# EAGLE design W032 (EAGLE 6.6.0)
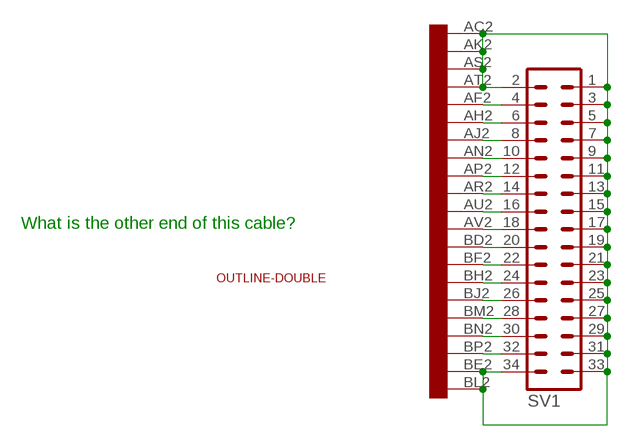
[diagram p0: schematic, sheet 1]

## Parts
SV1  MA17-2  [MA17-2]
U$1  OUTLINE-DOUBLE  [DOUBLE]
U$2  DOUBLE  [EDGE-CON4]

## Nets
GND: SV1.1 SV1.2 SV1.3 SV1.5 SV1.7 SV1.9 SV1.11 SV1.13 SV1.15 SV1.17 SV1.19 SV1.21 SV1.23 SV1.25 SV1.27 SV1.29 SV1.31 SV1.33 SV1.34 U$2.AC2 U$2.AK2 U$2.AS2 U$2.AT2 U$2.BE2 U$2.BL2
N$2: SV1.4 U$2.AF2
N$3: SV1.6 U$2.AH2
N$4: SV1.8 U$2.AJ2
N$5: SV1.10 U$2.AN2
N$6: SV1.12 U$2.AP2
N$7: SV1.14 U$2.AR2
N$8: SV1.16 U$2.AU2
N$9: SV1.18 U$2.AV2
N$10: SV1.20 U$2.BD2
N$11: SV1.22 U$2.BF2
N$12: SV1.24 U$2.BH2
N$13: SV1.26 U$2.BJ2
N$14: SV1.28 U$2.BM2
N$15: SV1.30 U$2.BN2
N$16: SV1.32 U$2.BP2
Unconnected: U$2.AA1 U$2.AA2 U$2.AB1 U$2.AB2 U$2.AC1 U$2.AD1 U$2.AD2 U$2.AE1 U$2.AE2 U$2.AF1 U$2.AH1 U$2.AJ1 U$2.AK1 U$2.AL1 U$2.AL2 U$2.AM1 U$2.AM2 U$2.AN1 U$2.AP1 U$2.AR1 U$2.AS1 U$2.AT1 U$2.AU1 U$2.AV1 U$2.BA1 U$2.BA2 U$2.BB1 U$2.BB2 U$2.BC1 U$2.BC2 U$2.BD1 U$2.BE1 U$2.BF1 U$2.BH1 U$2.BJ1 U$2.BK1 U$2.BK2 U$2.BL1 U$2.BM1 U$2.BN1 U$2.BP1 U$2.BR1 U$2.BR2 U$2.BS1 U$2.BS2 U$2.BT1 U$2.BT2 U$2.BU1 U$2.BU2 U$2.BV1 U$2.BV2

## Notes on the sheet
- What is the other end of this cable?

## Library data of the parts
SV1 = con-lstb:MA17-2: PIN HEADER; OC_FARNELL: unknown; OC_NEWARK: unknown
U$1 = dec-con:OUTLINE-*: Board outlines for DEC boards.
U$2 = dec-con:DOUBLE: Double-Height DEC board

## Board
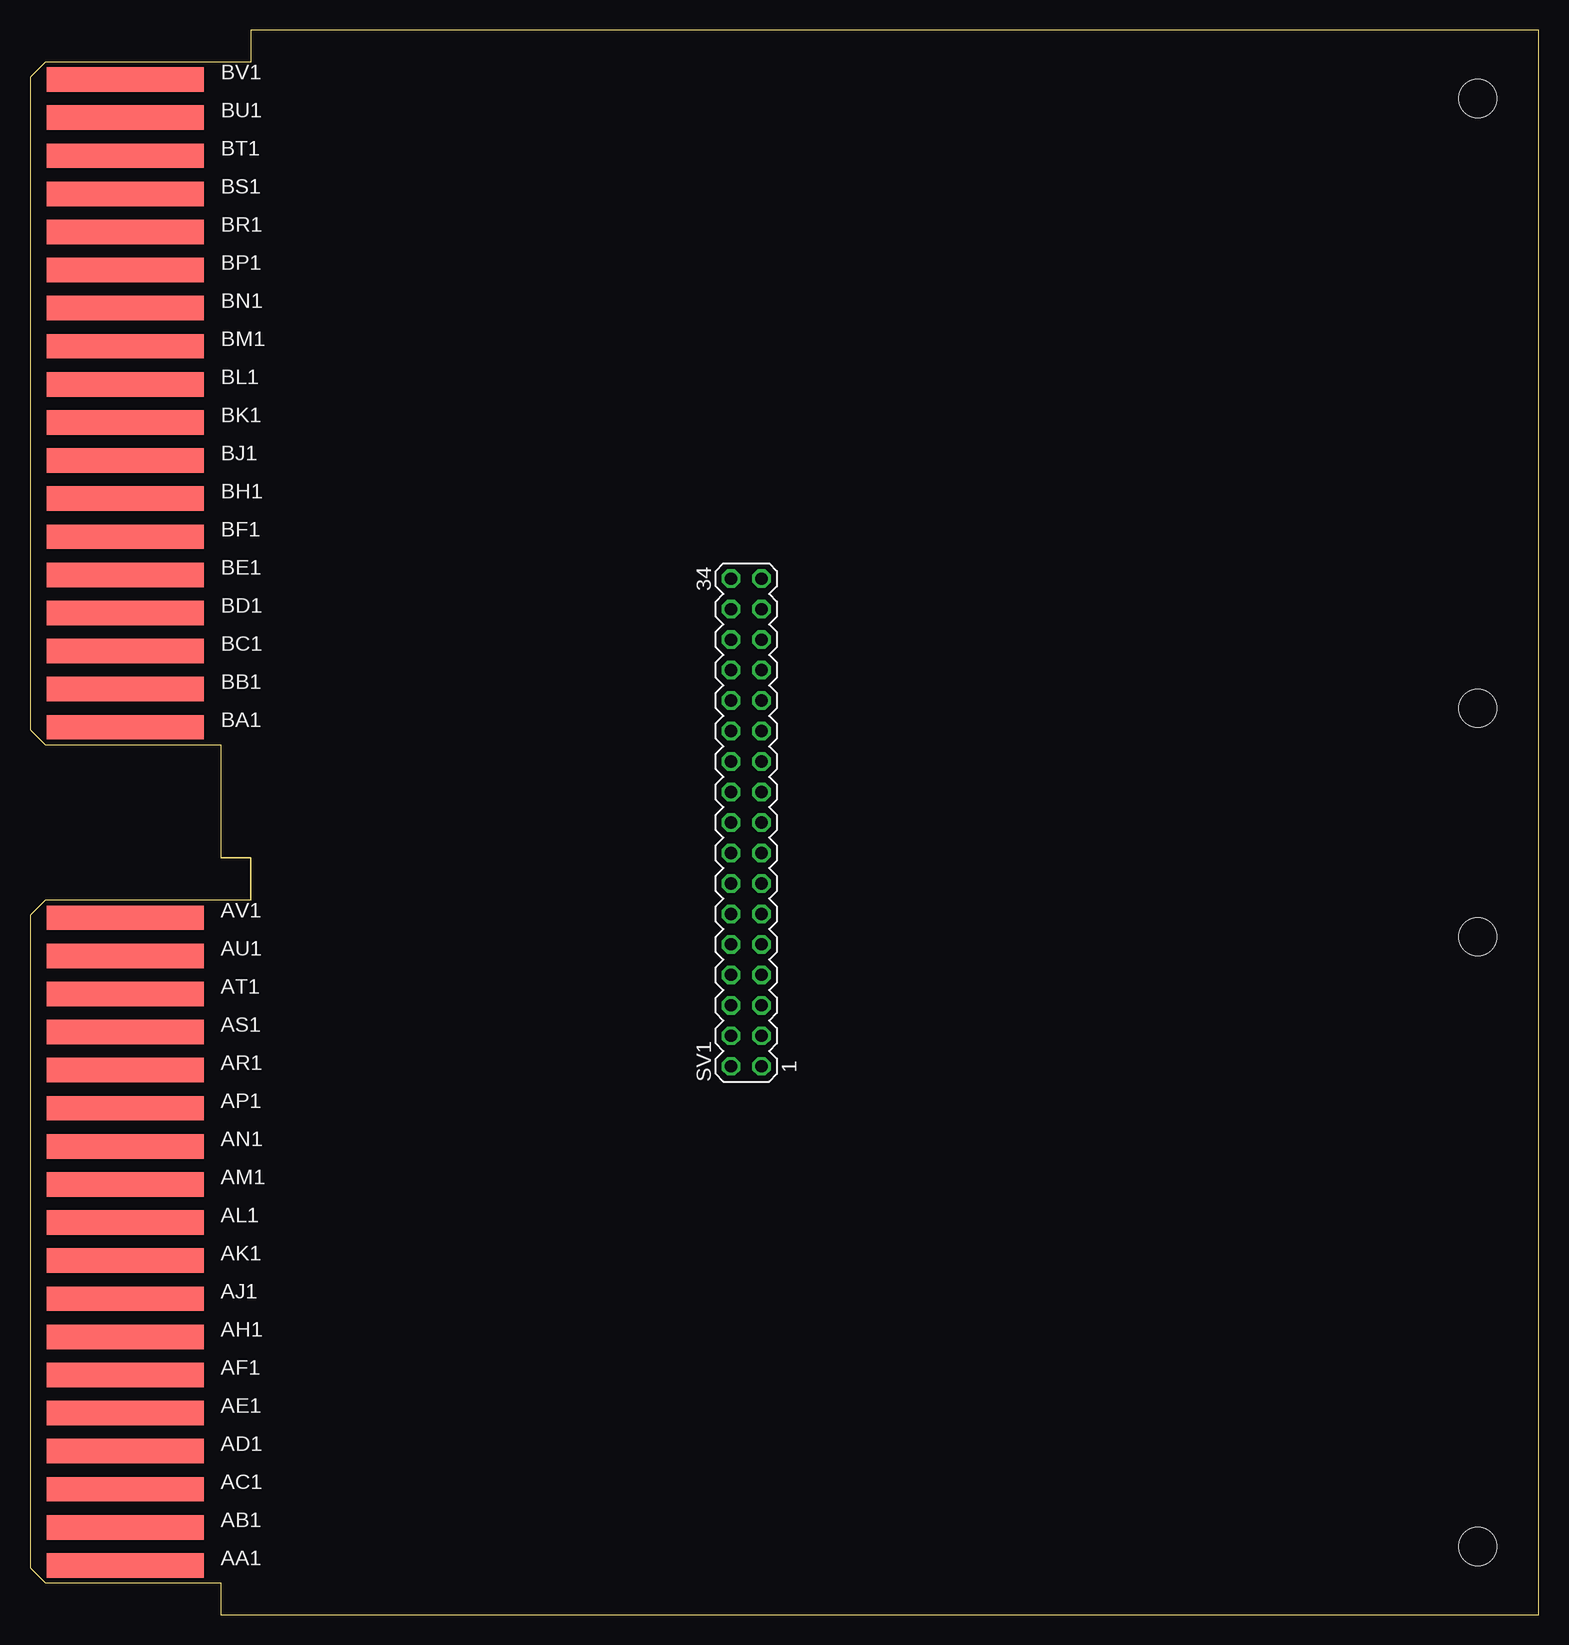
[diagram p1: board, top side]
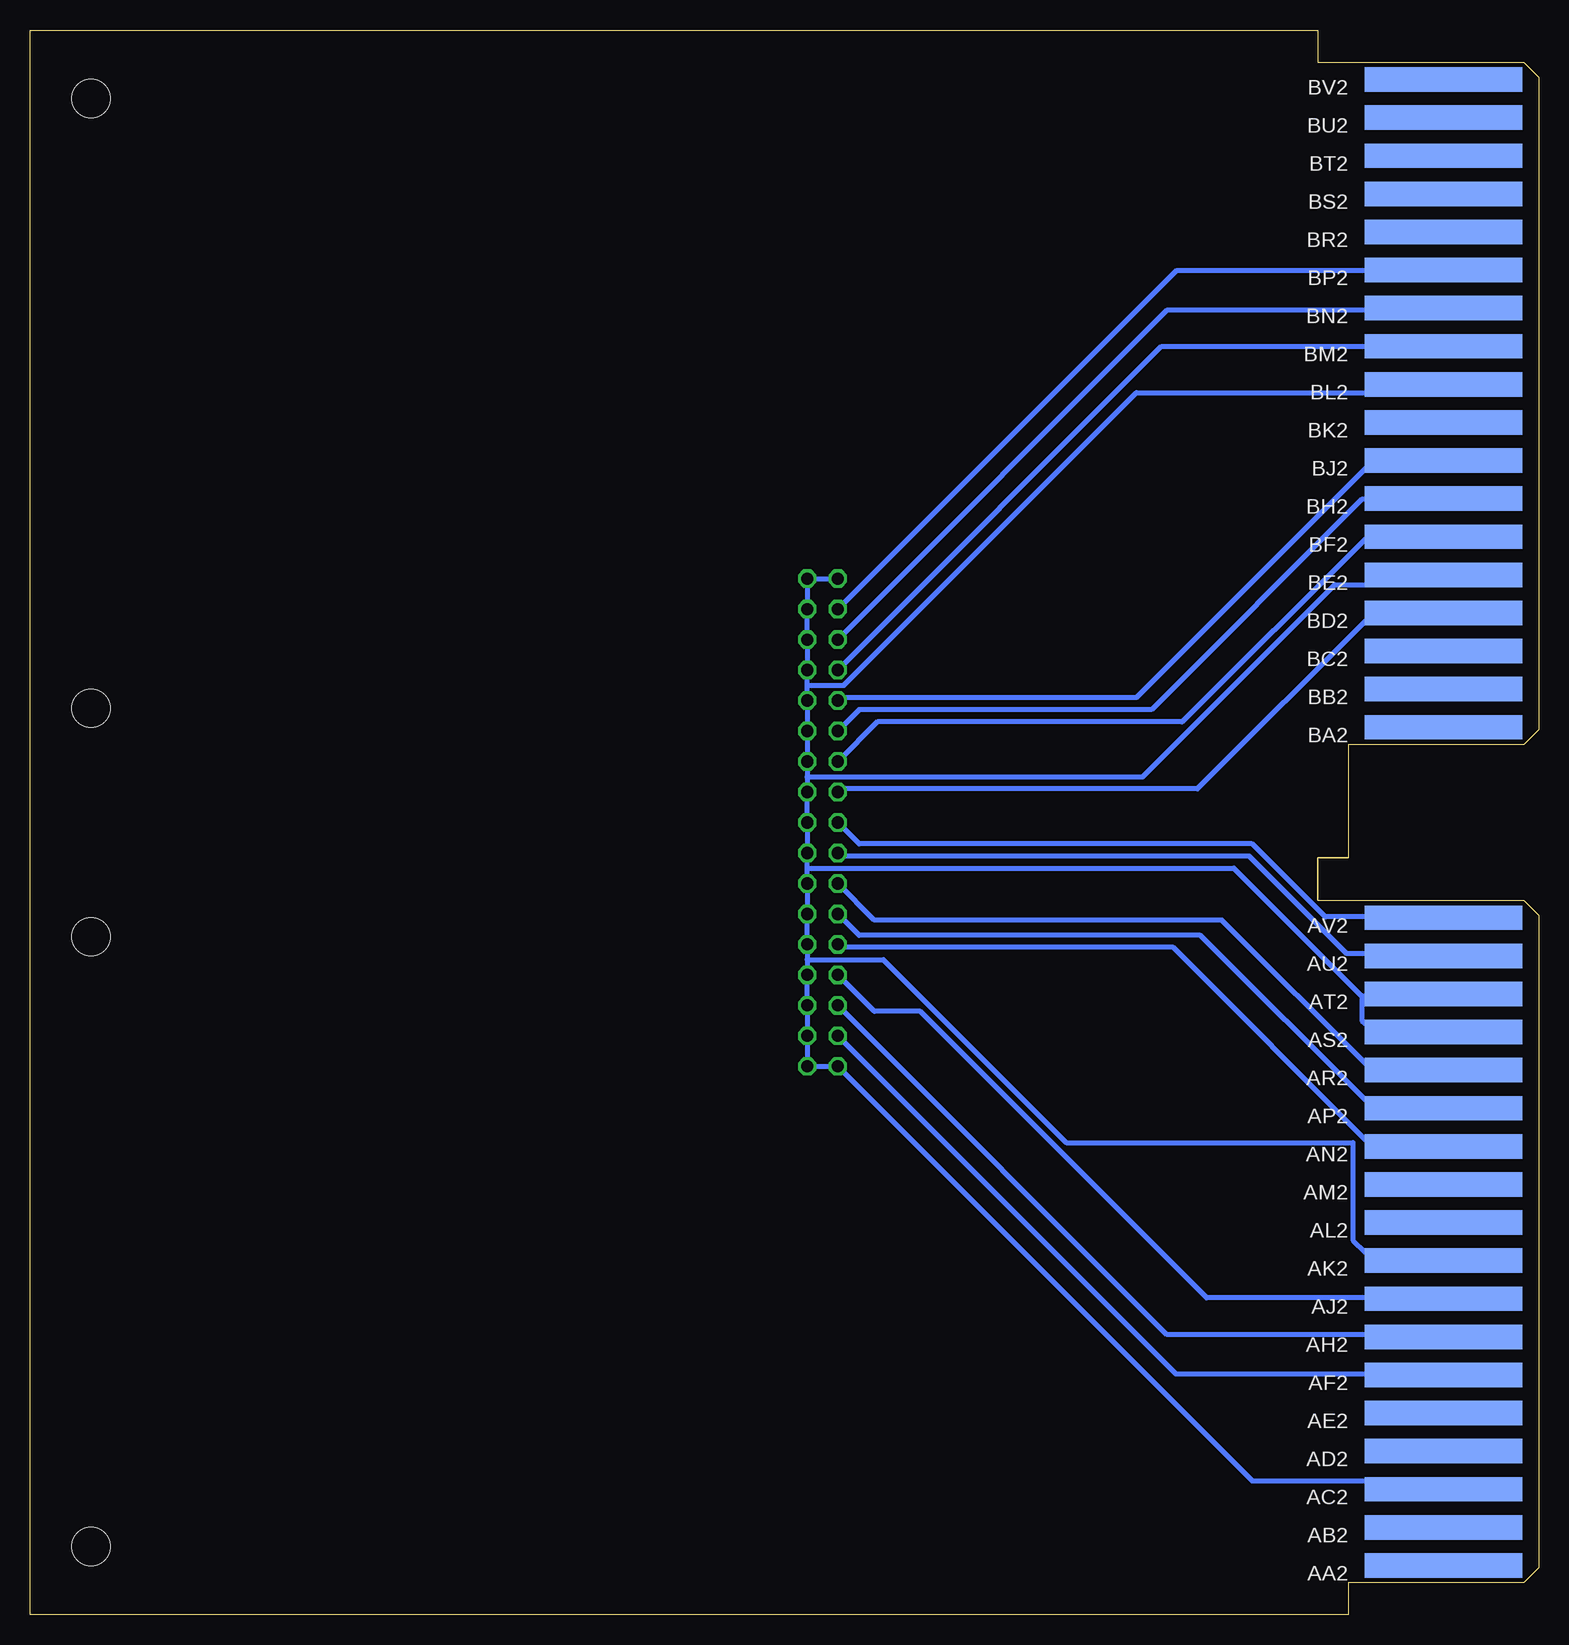
[diagram p2: board, bottom side, seen from below]

Size 125.73 x 132.08 mm. Coordinates in mm from the lower left corner, seen from the top.
Copper layers (1+16): Top 0.035mm / dielectric 1.5mm / Bottom 0.035mm
Design rules "16mils": minimum track width 16mil, minimum drill 32mil, track to track 15mil, track to pad 10mil, pad to pad 10mil, via to via 10mil, smd to smd 10mil, copper to edge 13mil, drill to drill 10mil, minimum pad ring 10mil, minimum via ring 8mil, stop-mask expansion 0mil, vias tented up to drill 0mil, thermal gap 10mil
vRestrict: area 31.8,108 to 41.9,125.7; area 49.5,108 to 59.7,125.7; area 67.3,108 to 77.5,125.7; area 85.1,108 to 95.3,125.7; area 102.9,108 to 113,125.7; area 31.8,80 to 41.9,97.8; area 49.5,80 to 59.7,97.8; area 67.3,80 to 77.5,97.8; area 85.1,80 to 95.3,97.8; area 31.8,34.3 to 41.9,52.1; area 49.5,34.3 to 59.7,52.1; area 67.3,34.3 to 77.5,52.1; area 85.1,34.3 to 95.3,52.1; area 102.9,11.4 to 113,29.2; area 85.1,11.4 to 95.3,29.2; area 49.5,11.4 to 59.7,29.2; area 31.8,11.4 to 41.9,29.2; area 67.3,11.4 to 77.5,29.2

### Footprints (pad centres in the part's own frame; a part is rotated, then mirrored left to right if it is on the bottom)
MA17-2 = drill 1.016 octagon: 1 -20.32,-1.27; 2 -20.32,1.27; 3 -17.78,-1.27; 4 -17.78,1.27; 5 -15.24,-1.27; 6 -15.24,1.27; 7 -12.7,-1.27; 8 -12.7,1.27; 9 -10.16,-1.27; 10 -10.16,1.27; 11 -7.62,-1.27; 12 -7.62,1.27; 13 -5.08,-1.27; 14 -5.08,1.27; 15 -2.54,-1.27; 16 -2.54,1.27; 17 0,-1.27; 18 0,1.27; 19 2.54,-1.27; 20 2.54,1.27; 21 5.08,-1.27; 22 5.08,1.27; 23 7.62,-1.27; 24 7.62,1.27; 25 10.16,-1.27; 26 10.16,1.27; 27 12.7,-1.27; 28 12.7,1.27; 29 15.24,-1.27; 30 15.24,1.27; 31 17.78,-1.27; 32 17.78,1.27; 33 20.32,-1.27; 34 20.32,1.27
DOUBLE = hole 3.175: 120.65,56.515; 120.65,5.715; 120.65,75.565; 120.65,126.365
EDGE-CON4 = smd 13.106 x 2.032: AA1 7.938,4.128; AB1 7.938,7.303; AC1 7.938,10.477; AD1 7.938,13.652; AE1 7.938,16.828; AF1 7.938,20.003; AH1 7.938,23.177; AJ1 7.938,26.352; AK1 7.938,29.527; AL1 7.938,32.703; AM1 7.938,35.877; AN1 7.938,39.053; AP1 7.938,42.227; AR1 7.938,45.403; AS1 7.938,48.578; AT1 7.938,51.752; AU1 7.938,54.928; AV1 7.938,58.102; BA1 7.938,73.978; BB1 7.938,77.153; BC1 7.938,80.328; BD1 7.938,83.502; BE1 7.938,86.677; BF1 7.938,89.853; BH1 7.938,93.028; BJ1 7.938,96.203; BK1 7.938,99.377; BL1 7.938,102.552; BM1 7.938,105.728; BN1 7.938,108.903; BP1 7.938,112.078; BR1 7.938,115.252; BS1 7.938,118.427; BT1 7.938,121.603; BU1 7.938,124.778; BV1 7.938,127.953 | smd 13.106 x 2.032 bottom: AA2 7.938,4.128; AB2 7.938,7.303; AC2 7.938,10.477; AD2 7.938,13.652; AE2 7.938,16.828; AF2 7.938,20.003; AH2 7.938,23.177; AJ2 7.938,26.352; AK2 7.938,29.527; AL2 7.938,32.703; AM2 7.938,35.877; AN2 7.938,39.053; AP2 7.938,42.227; AR2 7.938,45.403; AS2 7.938,48.578; AT2 7.938,51.752; AU2 7.938,54.928; AV2 7.938,58.102; BA2 7.938,73.978; BB2 7.938,77.153; BC2 7.938,80.328; BD2 7.938,83.502; BE2 7.938,86.677; BF2 7.938,89.853; BH2 7.938,93.028; BJ2 7.938,96.203; BK2 7.938,99.377; BL2 7.938,102.552; BM2 7.938,105.728; BN2 7.938,108.903; BP2 7.938,112.078; BR2 7.938,115.252; BS2 7.938,118.427; BT2 7.938,121.603; BU2 7.938,124.778; BV2 7.938,127.953

### Placement (x,y rotation side)
SV1  59.69,66.04 90 top
U$1  0,0 0 top
U$2  0,0 0 top

### Tracks (layer width: path | path; a pad name or v marks a point on that pad's centre or on a via)
GND
  Bottom 0.406: U$2.AS2 8.64,49.28 14.48,49.28 14.73,49.53 14.73,51.56 | 14.73,51.56 8.13,51.56 U$2.AT2 | SV1.34 SV1.33 SV1.31 SV1.29 SV1.27 60.96,77.47 | 60.96,69.85 SV1.21 SV1.23 SV1.25 60.96,77.47 | 60.96,69.85 SV1.19 SV1.17 SV1.15 60.96,62.23 | 60.96,54.61 SV1.9 SV1.11 SV1.13 60.96,62.23 | 60.96,54.61 SV1.7 SV1.5 SV1.3 SV1.1 SV1.2 23.88,11.18 8.64,11.18 U$2.AC2 | U$2.AK2 8.64,30.23 14.48,30.23 15.49,31.24 15.49,39.37 39.37,39.37 54.61,54.61 60.96,54.61 | U$2.BL2 8.64,101.85 33.53,101.85 57.91,77.47 60.96,77.47 | 14.73,51.56 25.4,62.23 60.96,62.23 | 60.96,69.85 33.02,69.85 17.02,85.85 8.89,85.85 8.13,86.61 U$2.BE2
N$2
  Bottom 0.406: SV1.4 30.23,20.07 8.13,20.07 U$2.AF2
N$3
  Bottom 0.406: SV1.6 30.99,23.37 8.13,23.37 U$2.AH2
N$4
  Bottom 0.406: SV1.8 55.37,50.29 51.56,50.29 27.69,26.42 8.13,26.42 U$2.AJ2
N$5
  Bottom 0.406: SV1.10 58.17,55.63 30.48,55.63 13.97,39.12 8.13,39.12 U$2.AN2
N$6
  Bottom 0.406: SV1.12 56.64,56.64 28.19,56.64 13.97,42.42 8.13,42.42 U$2.AP2
N$7
  Bottom 0.406: SV1.14 55.37,57.91 26.42,57.91 13.97,45.47 8.13,45.47 U$2.AR2
N$8
  Bottom 0.406: SV1.16 58.17,63.25 24.13,63.25 16,55.12 8.13,55.12 U$2.AU2
N$9
  Bottom 0.406: SV1.18 56.64,64.26 23.88,64.26 17.78,58.17 8.13,58.17 U$2.AV2
N$10
  Bottom 0.406: SV1.20 58.17,68.83 28.45,68.83 13.97,83.31 8.13,83.31 U$2.BD2
N$11
  Bottom 0.406: SV1.22 55.12,74.42 29.72,74.42 14.48,89.66 8.13,89.66 U$2.BF2
N$12
  Bottom 0.406: SV1.24 56.64,75.44 32.26,75.44 14.73,92.96 8.13,92.96 U$2.BH2
N$13
  Bottom 0.406: SV1.26 58.17,76.45 33.53,76.45 13.97,96.01 8.13,96.01 U$2.BJ2
N$14
  Bottom 0.406: SV1.28 31.5,105.66 8.13,105.66 U$2.BM2
N$15
  Bottom 0.406: SV1.30 30.99,108.71 8.13,108.71 U$2.BN2
N$16
  Bottom 0.406: SV1.32 30.23,112.01 8.13,112.01 U$2.BP2